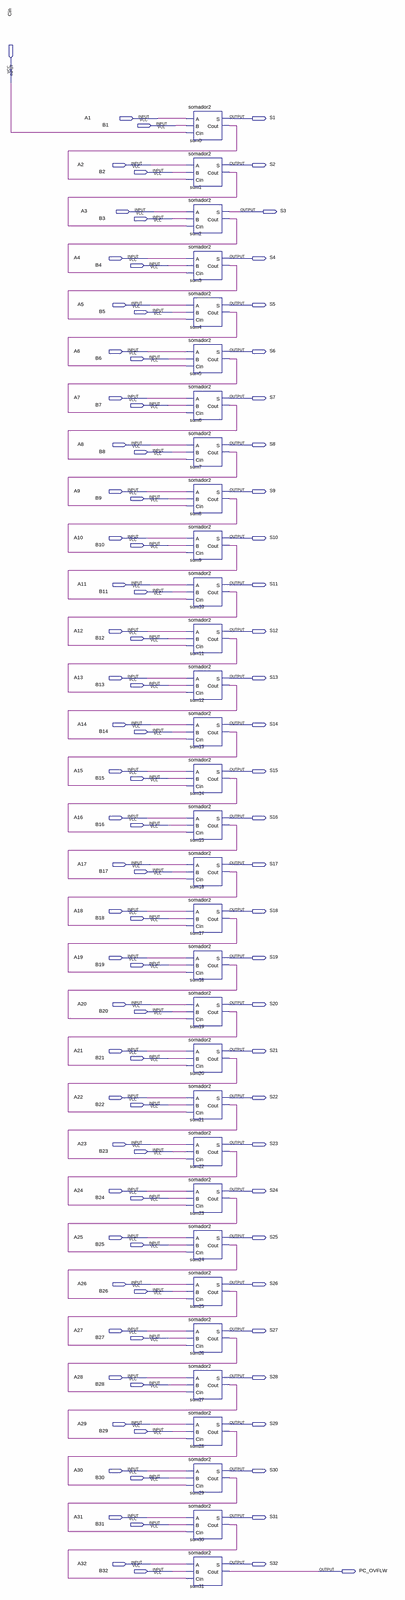
[diagram p0: schematic sheet, whole]
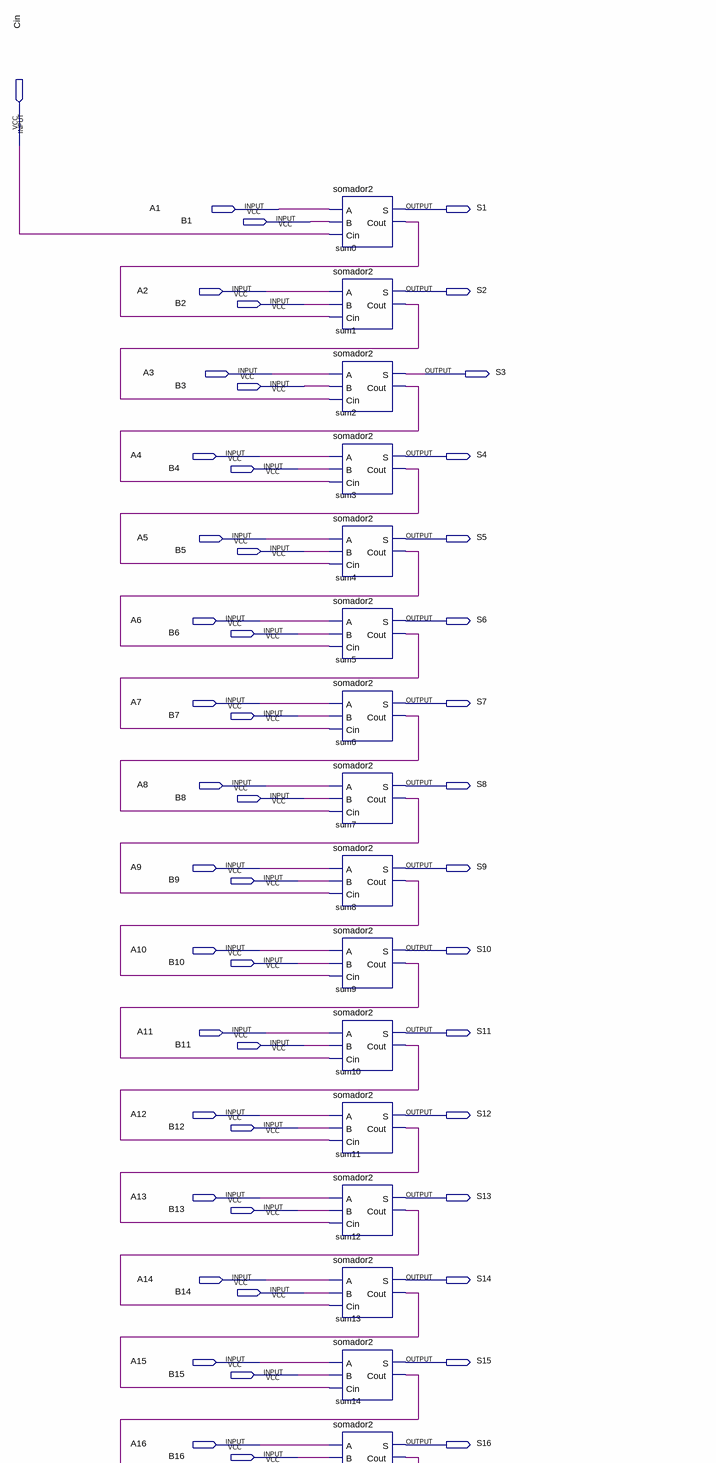
[diagram p1: schematic sheet, upper part]
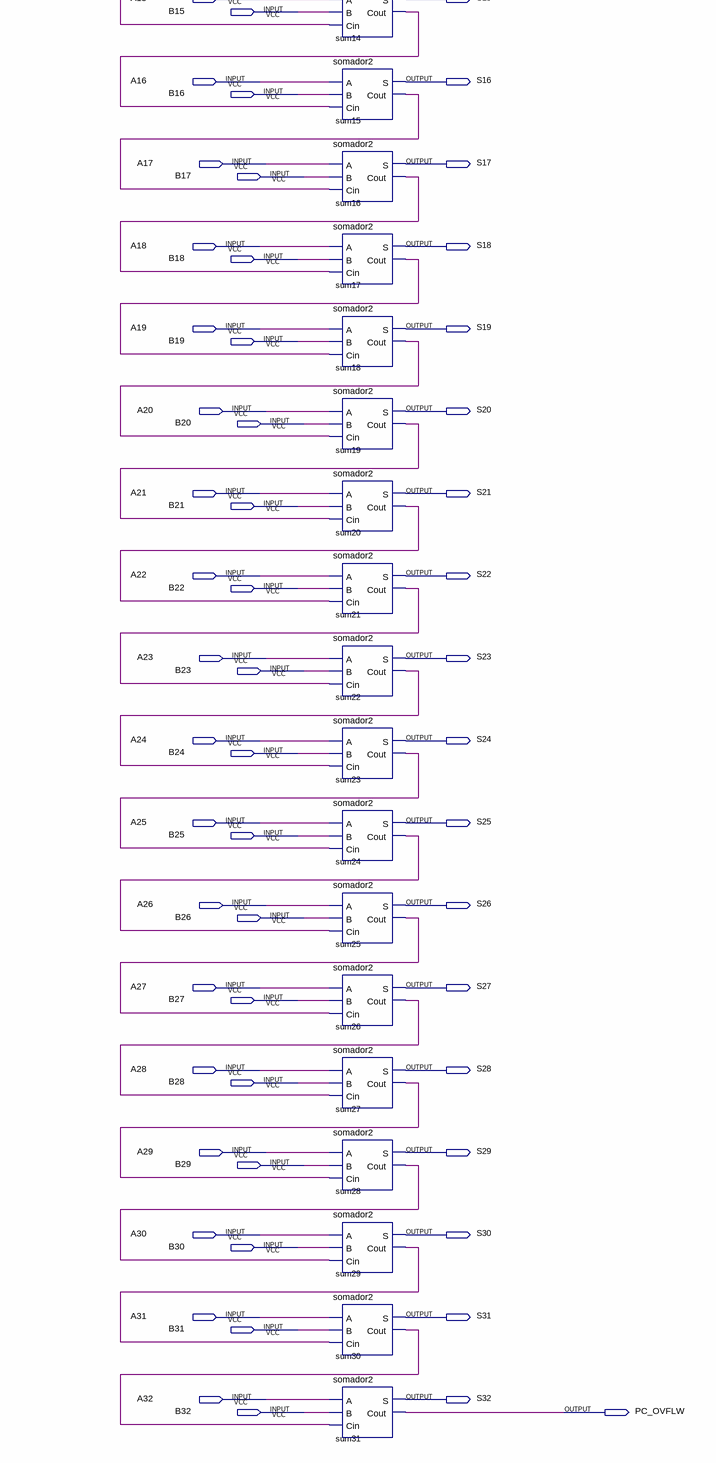
[diagram p2: schematic sheet, lower part]
// Quartus schematic somador32.bdf as structural Verilog: 32 symbols, 98 pins
module somador32 (
  input  Cin,
  input  A1,
  input  B1,
  input  A2,
  input  B2,
  input  A3,
  input  B3,
  input  A4,
  input  B4,
  input  A5,
  input  B5,
  input  A6,
  input  B6,
  input  A7,
  input  B7,
  input  A8,
  input  B8,
  input  A9,
  input  B9,
  input  A10,
  input  B10,
  input  A11,
  input  B11,
  input  A12,
  input  B12,
  input  A13,
  input  B13,
  input  A14,
  input  B14,
  input  A15,
  input  B15,
  input  A16,
  input  B16,
  input  A17,
  input  B17,
  input  A18,
  input  B18,
  input  A19,
  input  B19,
  input  A20,
  input  B20,
  input  A21,
  input  B21,
  input  A22,
  input  B22,
  input  A23,
  input  B23,
  input  A24,
  input  B24,
  input  A25,
  input  B25,
  input  A26,
  input  B26,
  input  A27,
  input  B27,
  input  A28,
  input  B28,
  input  A29,
  input  B29,
  input  A30,
  input  B30,
  input  A31,
  input  B31,
  input  A32,
  input  B32,
  output S1,
  output S2,
  output S3,
  output S4,
  output S5,
  output S6,
  output S7,
  output S8,
  output S9,
  output S10,
  output S11,
  output S12,
  output S13,
  output S14,
  output S15,
  output S16,
  output S17,
  output S18,
  output S19,
  output S20,
  output S21,
  output S22,
  output S23,
  output S24,
  output S25,
  output S26,
  output S27,
  output S28,
  output S29,
  output S30,
  output S31,
  output S32,
  output PC_OVFLW
);

  wire sum0_cout, sum1_cout, sum2_cout, sum3_cout, sum4_cout, sum5_cout, sum6_cout, sum7_cout, sum8_cout,
       sum9_cout, sum10_cout, sum11_cout, sum12_cout, sum13_cout, sum14_cout, sum15_cout, sum16_cout,
       sum17_cout, sum18_cout, sum19_cout, sum20_cout, sum21_cout, sum22_cout, sum23_cout, sum24_cout,
       sum25_cout, sum26_cout, sum27_cout, sum28_cout, sum29_cout, sum30_cout;

  somador2 sum0 (.A(A1), .B(B1), .Cin(Cin), .S(S1), .Cout(sum0_cout));
  somador2 sum1 (.A(A2), .B(B2), .Cin(sum0_cout), .S(S2), .Cout(sum1_cout));
  somador2 sum2 (.A(A3), .B(B3), .Cin(sum1_cout), .S(S3), .Cout(sum2_cout));
  somador2 sum3 (.A(A4), .B(B4), .Cin(sum2_cout), .S(S4), .Cout(sum3_cout));
  somador2 sum4 (.A(A5), .B(B5), .Cin(sum3_cout), .S(S5), .Cout(sum4_cout));
  somador2 sum5 (.A(A6), .B(B6), .Cin(sum4_cout), .S(S6), .Cout(sum5_cout));
  somador2 sum6 (.A(A7), .B(B7), .Cin(sum5_cout), .S(S7), .Cout(sum6_cout));
  somador2 sum7 (.A(A8), .B(B8), .Cin(sum6_cout), .S(S8), .Cout(sum7_cout));
  somador2 sum8 (.A(A9), .B(B9), .Cin(sum7_cout), .S(S9), .Cout(sum8_cout));
  somador2 sum9 (.A(A10), .B(B10), .Cin(sum8_cout), .S(S10), .Cout(sum9_cout));
  somador2 sum10 (.A(A11), .B(B11), .Cin(sum9_cout), .S(S11), .Cout(sum10_cout));
  somador2 sum11 (.A(A12), .B(B12), .Cin(sum10_cout), .S(S12), .Cout(sum11_cout));
  somador2 sum12 (.A(A13), .B(B13), .Cin(sum11_cout), .S(S13), .Cout(sum12_cout));
  somador2 sum13 (.A(A14), .B(B14), .Cin(sum12_cout), .S(S14), .Cout(sum13_cout));
  somador2 sum14 (.A(A15), .B(B15), .Cin(sum13_cout), .S(S15), .Cout(sum14_cout));
  somador2 sum15 (.A(A16), .B(B16), .Cin(sum14_cout), .S(S16), .Cout(sum15_cout));
  somador2 sum16 (.A(A17), .B(B17), .Cin(sum15_cout), .S(S17), .Cout(sum16_cout));
  somador2 sum17 (.A(A18), .B(B18), .Cin(sum16_cout), .S(S18), .Cout(sum17_cout));
  somador2 sum18 (.A(A19), .B(B19), .Cin(sum17_cout), .S(S19), .Cout(sum18_cout));
  somador2 sum19 (.A(A20), .B(B20), .Cin(sum18_cout), .S(S20), .Cout(sum19_cout));
  somador2 sum20 (.A(A21), .B(B21), .Cin(sum19_cout), .S(S21), .Cout(sum20_cout));
  somador2 sum21 (.A(A22), .B(B22), .Cin(sum20_cout), .S(S22), .Cout(sum21_cout));
  somador2 sum22 (.A(A23), .B(B23), .Cin(sum21_cout), .S(S23), .Cout(sum22_cout));
  somador2 sum23 (.A(A24), .B(B24), .Cin(sum22_cout), .S(S24), .Cout(sum23_cout));
  somador2 sum24 (.A(A25), .B(B25), .Cin(sum23_cout), .S(S25), .Cout(sum24_cout));
  somador2 sum25 (.A(A26), .B(B26), .Cin(sum24_cout), .S(S26), .Cout(sum25_cout));
  somador2 sum26 (.A(A27), .B(B27), .Cin(sum25_cout), .S(S27), .Cout(sum26_cout));
  somador2 sum27 (.A(A28), .B(B28), .Cin(sum26_cout), .S(S28), .Cout(sum27_cout));
  somador2 sum28 (.A(A29), .B(B29), .Cin(sum27_cout), .S(S29), .Cout(sum28_cout));
  somador2 sum29 (.A(A30), .B(B30), .Cin(sum28_cout), .S(S30), .Cout(sum29_cout));
  somador2 sum30 (.A(A31), .B(B31), .Cin(sum29_cout), .S(S31), .Cout(sum30_cout));
  somador2 sum31 (.A(A32), .B(B32), .Cin(sum30_cout), .S(S32), .Cout(PC_OVFLW));
endmodule
